# Altium schematic sheet LTC6268-diff-iso.SchDoc
size A3
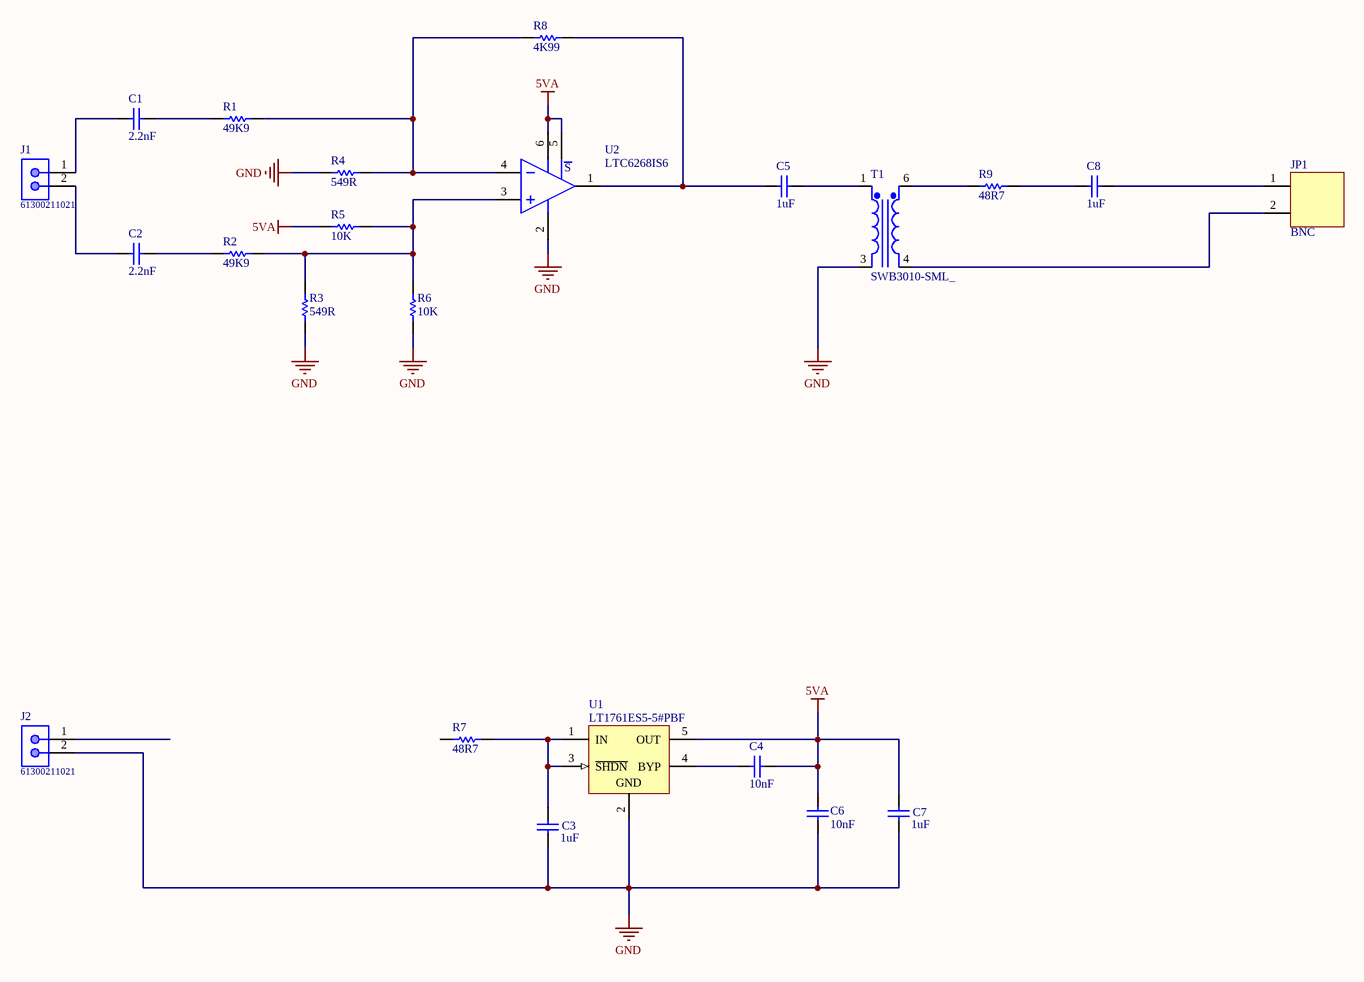
[diagram p0: LTC6268-diff-iso.SchDoc]

## Parts
C1  value 2.2nF  [CAPC1210(3225)170_L]  (hidden comment: CAP 2.2nF 630V 1210(3225))
C2  value 2.2nF  [CAPC1210(3225)170_L]  (hidden comment: CAP 2.2nF 630V 1210(3225))
C3  value 1uF  [CAPC0805(2012)145_L]  (hidden comment: CAP 1uF 16V 0805(2012))
C4  value 10nF  [CAPC0402(1005)33_N]  (hidden comment: CAP 10nF 16V 0402(1005))
C5  value 1uF  [CAPC1210(3225)135_L]  (hidden comment: FCA1210C105M-G2)
C6  value 10nF  [CAPC0402(1005)33_N]  (hidden comment: CAP 10nF 16V 0402(1005))
C7  value 1uF  [CAPC0805(2012)145_L]  (hidden comment: CAP 1uF 16V 0805(2012))
C8  value 1uF  [CAPC1210(3225)135_L]  (hidden comment: FCA1210C105M-G2)
J1  61300211021  [61300211021]
J2  61300211021  [61300211021]
JP1  BNC  [CONN-BNC-1-1337542-0]
R1  value 49K9  [RESC0402(1005)_N]  (hidden comment: 49K9 1% 0402(1005))
R2  value 49K9  [RESC0402(1005)_N]  (hidden comment: 49K9 1% 0402(1005))
R3  value 549R  [RESC0402(1005)_N]  (hidden comment: 549R 1% 0402(1005))
R4  value 549R  [RESC0402(1005)_N]  (hidden comment: 549R 1% 0402(1005))
R5  value 10K  [RESC0402(1005)_N]  (hidden comment: 10K 1% 0402(1005))
R6  value 10K  [RESC0402(1005)_N]  (hidden comment: 10K 1% 0402(1005))
R7  value 48R7  [RESC0402(1005)_N]  (hidden comment: 48R7 1% 0402(1005))
R8  value 4K99  [RESC0402(1005)_N]  (hidden comment: 4K99 1% 0402(1005))
R9  value 48R7  [RESC0402(1005)_N]  (hidden comment: 48R7 1% 0402(1005))
T1  SWB3010-SML_  [Coilcraft-SWB]
U1  LT1761ES5-5#PBF  [LT-S5-5-TSOT-23_M]
U2  LTC6268IS6  [LT-S6-6-TSOT-23_L]

## Nets
5VA: C4.1 C6.1 C7.2 R5.2 U1.5(OUT) U2.5(SHUTDOWNn) U2.6(V+)
GND: C3.1 C6.2 C7.1 J2.2 R3.1 R4.2 R6.1 T1.3 U1.2(GND) U2.2(V-)
NetC1_1: C1.1 J1.1
NetC1_2: C1.2 R1.1
NetC2_1: C2.1 J1.2
NetC2_2: C2.2 R2.2
NetC3_2: C3.2 R7.2 U1.1(IN) U1.3(~{SHDN})
NetC4_2: C4.2 U1.4(BYP)
NetC5_1: C5.1 R8.1 U2.1(OUT1)
NetC5_2: C5.2 T1.1
NetC8_1: C8.1 R9.2
NetC8_2: C8.2 JP1.1
NetJP1_2: JP1.2 T1.4
NetR1_2: R1.2 R4.1 R8.2 U2.4(IN1-)
NetR2_1: R2.1 R3.2 R5.1 R6.2 U2.3(IN1+)
NetR9_1: R9.1 T1.6

Not connected (* = marked no-connect by the designer): J2 1; R7 1

## Notes on the sheet
- (in symbol IC-LINEAR-LTC6268IS6#TRMPBF) S

## Library data of the parts
C1 C2 = CMP-1038-00746-1: CAP 2.2nF 630V ±5% 1210 (3225 Metric) Thickness 1.7mm SMD; MPN: C1210C222JDGACTU; Case-EIA: 1210; Case-Metric: 3225; Tolerance: Â±5%; Max Thickness: 1.7 mm; Technology: SMT; Rated Voltage: 630 V; DigiKey: 399-11204-6-ND
C3 C7 = CMP-1036-04746-1: CAP 1uF 16V ±10% 0805 (2012 Metric) Thickness 1.45mm SMD; Case-EIA: 0805; Case-Metric: 2012; Tolerance: Â±10%; Rated Voltage: 16 V; Max Thickness: 1.45 mm; Technology: SMT
C4 C6 = CMP-1034-01875-1: CAP 10nF 16V ±10% 0402 (1005 Metric) Thickness 0.33mm SMD; Case-EIA: 0402; Tolerance: Â±10%; Case-Metric: 1005; Max Thickness: 0.33 mm; Rated Voltage: 16 V; Technology: SMT
C5 C8 = CAP_1210_1UF16V_FCA: CAP FILM 1UF 20% 16VDC 1210; Voltage: 16V; PackageReference: 1210; FARNELL: 2112915; MPN: FCA1210C105M-G2; DigiKey: 338-2778-2-ND
J1 J2 = 61300211021: THT Angled Pin Header WR-PHD, Pitch 2.54 mm, Single Row, 2 pins; Pin Number: 2; Pitch: 2.54 mm; Gender: Male; Rated Current: 3 A; Working Voltage: 250 VAC; Withstanding Voltage: 500 VAC; Contact Resistance: 20 mOhm; ComponentLink1Description: Manufacturer; ComponentLink1URL: http://www.we-online.de; ComponentLink2Description: Datasheet; ComponentLink2URL: https://katalog.we-online.de/em/datasheet/6130xx11021.pdf; Part Number: 61300211021; Published Date: August 2018; Publisher: Wurth Elektronik; Operating Temperature: -40 to 105 degC; Mounting Technology: THT; Packaging: Bag; Row Number: Single; Orientation: Angled
JP1 = CONN-BNC-1-1337542-0: BNC Connector Jack, Female Socket 50 Ohm Panel Mount, Through Hole, Right Angle Solder; MPN: 1-1337542-0
R1 R2 = CMP-1011-00702-1: 49K9 0.063W 1% 0402 (1005 Metric)  SMD; Case-Metric: 1005; Case-EIA: 0402; Power: 0.063 W; Tolerance: 1 %; Technology: SMT
R3 R4 = CMP-1011-00481-1: 549R 0.063W 1% 0402 (1005 Metric)  SMD; Case-EIA: 0402; Case-Metric: 1005; Tolerance: 1 %; Power: 0.063 W; Technology: SMT
R5 R6 = CMP-1011-00623-1: 10K 0.063W 1% 0402 (1005 Metric)  SMD; Case-Metric: 1005; Case-EIA: 0402; Tolerance: 1 %; Technology: SMT; Power: 0.063 W
R7 R9 = CMP-1011-00362-1: 48R7 0.063W 1% 0402 (1005 Metric)  SMD; Case-EIA: 0402; Case-Metric: 1005; Tolerance: 1 %; Power: 0.063 W; Technology: SMT
R8 = CMP-1011-00589-1: 4K99 0.063W 1% 0402 (1005 Metric)  SMD; Case-Metric: 1005; Case-EIA: 0402; Technology: SMT; Tolerance: 1 %; Power: 0.063 W
T1 = TRANS-SWB3010-SML_: Wideband RF Transformers – SWB; MPN: SWB3010-SML_
U1 = CMP-0476-01256-1: 100 mA, Low Noise, LDO Micropower Regulator, 1.8 to 20 V Vin, 5 V Vout, 5-pin SOT23 (S5-5), -40 to 125 degC, Pb-Free; Manufacturer: Linear Technology; Vin Max(V): 20; Iout(mA): 100; Dropout Voltage(V): 0.3; Vin Min(V): 1.8; Shutdown Current(uA): 1; Output Voltage: 5 V; PSRR(dB): 65; Discrete Pass Element: no; Isupply(mA): 0.02; PackageReference: S5-5; RoHS: TRUE; PackageVersion: Jun-10; DatasheetVersion: Rev. F; ComponentLink2Description: Datasheet; ComponentLink1Description: Manufacturer URL; Number of Outputs: 1; PackageDescription: 5-Pin Plastic TSOT-23, Body 1.63 x 2.90 mm, Pitch 0.95 mm; Mounting Technology: Surface Mount; ComponentLink1URL: http://www.linear.com/; Code_JEDEC: MO-193; ComponentLink2URL: http://cds.linear.com/docs/en/datasheet/1761sff.pdf; Noise(uV): 20; ComponentLink3Description: Package Specification; ComponentLink3URL: http://cds.linear.com/docs/en/packaging/SOT_5_05-08-1635.pdf; PartNumber: LT1761ES5-5#PBF
U2 = IC-LINEAR-LTC6268IS6#TRMPBF: IC OPAMP 500MHZ SGL FET TSOT23-6; Farnell: 2464181; MPN: LTC6268IS6#TRMPBF; DigiKey: LTC6268IS6#TRMPBFCT-ND